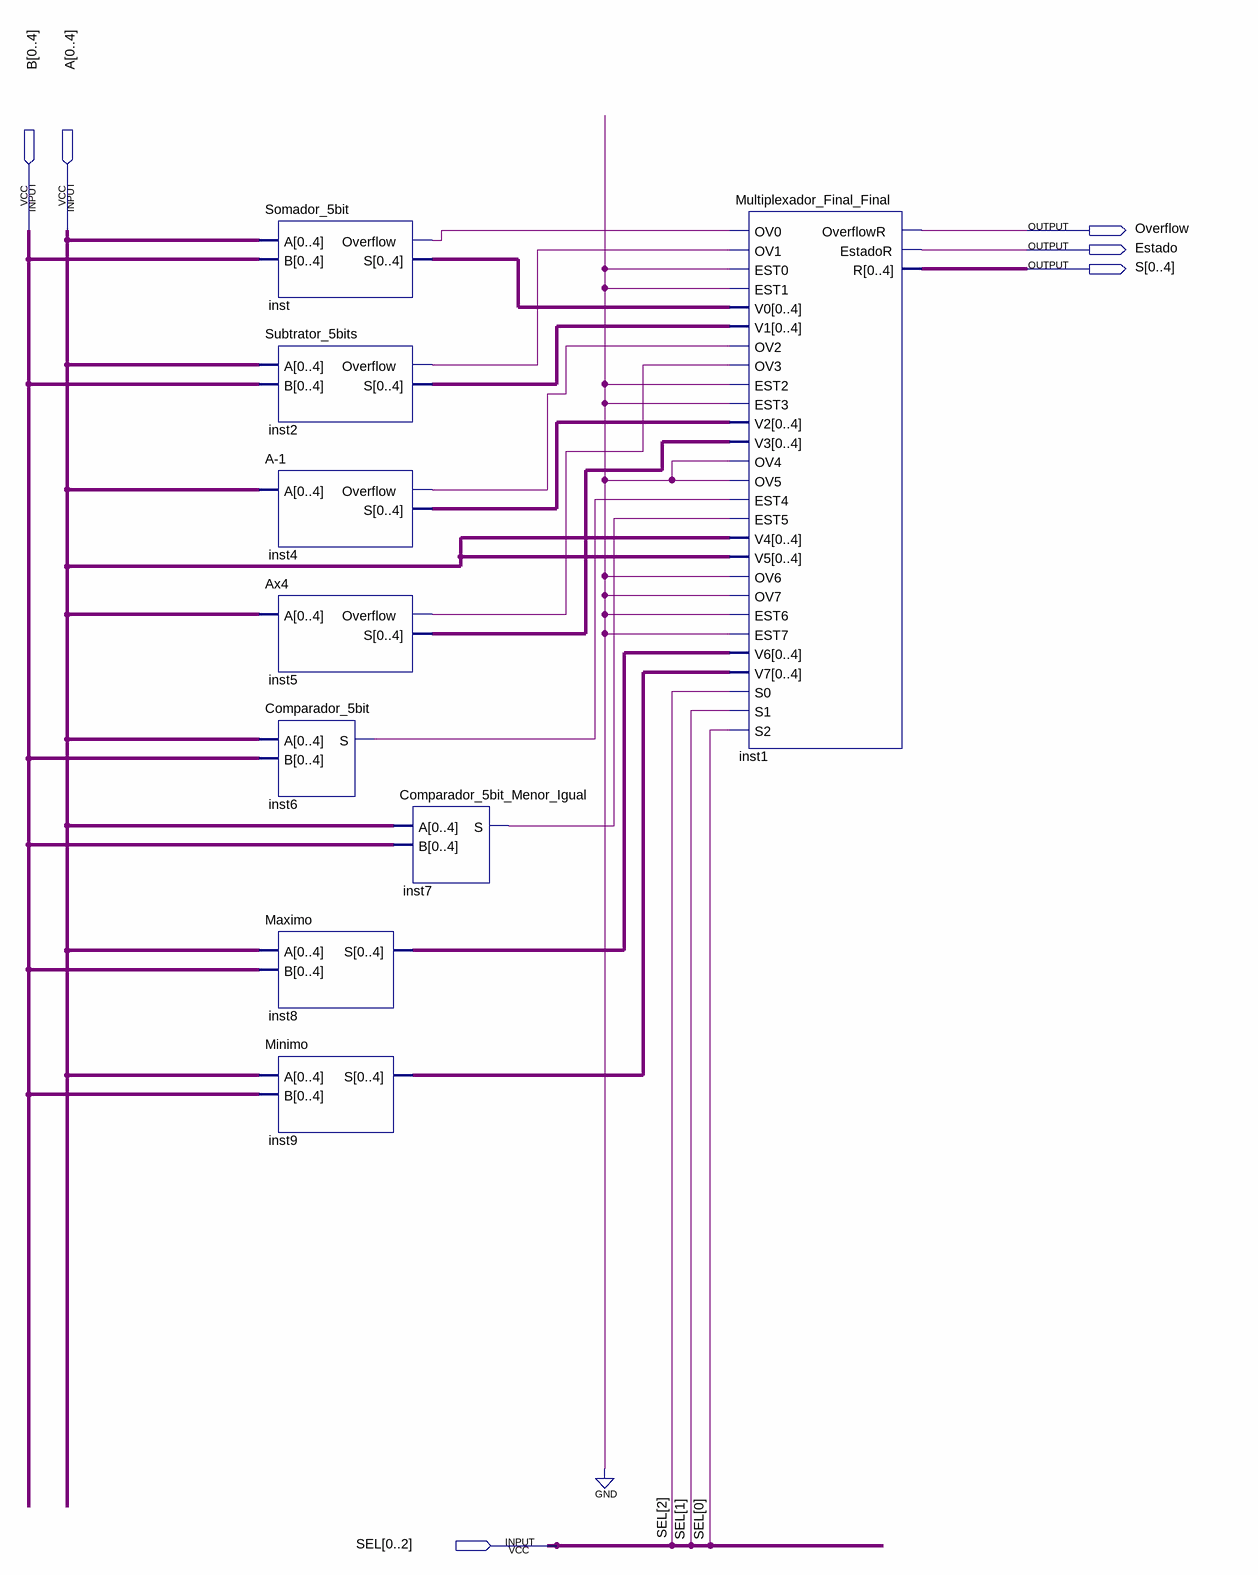
[diagram p0: schematic sheet]
// Quartus schematic Menu_Parte1.bdf as structural Verilog: 9 symbols, 6 pins
module Menu_Parte1 (
  input  [0:4] B,
  input  [0:4] A,
  input  [0:2] SEL,
  output Overflow,
  output Estado,
  output [0:4] S
);

  wire inst2_overflow, inst4_overflow, inst5_overflow, inst6_s, inst7_s, inst_overflow;
  wire [4:0] inst2_s, inst4_s, inst5_s, inst8_s, inst9_s, inst_s;

  Somador_5bit inst (.A(A), .B(B), .Overflow(inst_overflow), .S(inst_s));
  Subtrator_5bits inst2 (.A(A), .B(B), .Overflow(inst2_overflow), .S(inst2_s));
  \A-1  inst4 (.A(A), .Overflow(inst4_overflow), .S(inst4_s));
  Ax4 inst5 (.A(A), .Overflow(inst5_overflow), .S(inst5_s));
  Comparador_5bit inst6 (.A(A), .B(B), .S(inst6_s));
  Maximo inst8 (.A(A), .B(B), .S(inst8_s));
  Minimo inst9 (.A(A), .B(B), .S(inst9_s));
  Comparador_5bit_Menor_Igual inst7 (.A(A), .B(B), .S(inst7_s));
  Multiplexador_Final_Final inst1 (
    .OV0(inst_overflow), .OV1(inst2_overflow), .EST0(1'b0), .EST1(1'b0), .V0(inst_s), .V1(inst2_s),
    .OV2(inst4_overflow), .OV3(inst5_overflow), .EST2(1'b0), .EST3(1'b0), .V2(inst4_s), .V3(inst5_s),
    .OV4(1'b0), .OV5(1'b0), .EST4(inst6_s), .EST5(inst7_s), .V4(A), .V5(A), .OV6(1'b0), .OV7(1'b0),
    .EST6(1'b0), .EST7(1'b0), .V6(inst8_s), .V7(inst9_s), .S0(SEL[2]), .S1(SEL[1]), .S2(SEL[0]),
    .OverflowR(Overflow), .EstadoR(Estado), .R(S));
endmodule
